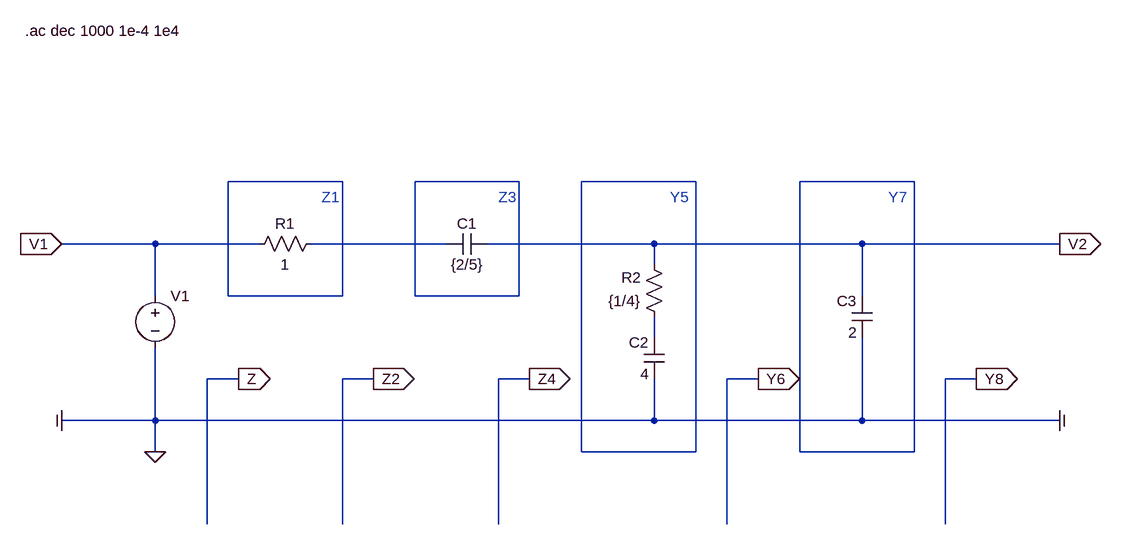
[diagram p0: schematic TS12_Ejercicio_2_LTSpice_Z11_Remociones.asc]
TS12_Ejercicio_2_LTSpice_Z11_Remociones.asc, the LTspice schematic file:
Version 4
SHEET 1 1456 772
WIRE -96 -32 -272 -32
WIRE 176 -32 16 -32
WIRE 448 -32 272 -32
WIRE 784 -32 608 -32
WIRE -384 64 -528 64
WIRE -224 64 -384 64
WIRE 64 64 -144 64
WIRE 384 64 128 64
WIRE 704 64 384 64
WIRE 1008 64 704 64
WIRE 384 96 384 64
WIRE -384 144 -384 64
WIRE -272 144 -272 -32
WIRE -96 144 -96 -32
WIRE -96 144 -272 144
WIRE 16 144 16 -32
WIRE 176 144 176 -32
WIRE 176 144 16 144
WIRE 704 144 704 64
WIRE 384 208 384 176
WIRE -256 272 -304 272
WIRE -48 272 -96 272
WIRE 192 272 144 272
WIRE 544 272 496 272
WIRE 880 272 832 272
WIRE -384 336 -384 224
WIRE -384 336 -528 336
WIRE 384 336 384 272
WIRE 384 336 -384 336
WIRE 704 336 704 208
WIRE 704 336 384 336
WIRE 1008 336 704 336
WIRE -384 384 -384 336
WIRE 272 384 272 -32
WIRE 448 384 448 -32
WIRE 448 384 272 384
WIRE 608 384 608 -32
WIRE 784 384 784 -32
WIRE 784 384 608 384
WIRE -304 496 -304 272
WIRE -96 496 -96 272
WIRE 144 496 144 272
WIRE 496 496 496 272
WIRE 832 496 832 272
FLAG 1008 64 V2
IOPIN 1008 64 Out
FLAG -528 64 V1
IOPIN -528 64 In
FLAG -384 384 0
FLAG -528 336 COM
IOPIN -528 336 In
FLAG 1008 336 COM
IOPIN 1008 336 Out
FLAG -256 272 Z
IOPIN -256 272 Out
FLAG -48 272 Z2
IOPIN -48 272 Out
FLAG 192 272 Z4
IOPIN 192 272 Out
FLAG 544 272 Y6
IOPIN 544 272 Out
FLAG 880 272 Y8
IOPIN 880 272 Out
SYMBOL res -128 48 R90
WINDOW 0 0 56 VBottom 2
WINDOW 3 32 56 VTop 2
SYMATTR InstName R1
SYMATTR Value 1
SYMBOL res 400 192 R180
WINDOW 0 36 76 Left 2
WINDOW 3 36 40 Left 2
SYMATTR InstName R2
SYMATTR Value {1/4}
SYMBOL cap 128 48 R90
WINDOW 0 0 32 VBottom 2
WINDOW 3 32 32 VTop 2
SYMATTR InstName C1
SYMATTR Value {2/5}
SYMBOL cap 400 272 R180
WINDOW 0 24 56 Left 2
WINDOW 3 24 8 Left 2
SYMATTR InstName C2
SYMATTR Value 4
SYMBOL cap 720 208 R180
WINDOW 0 24 56 Left 2
WINDOW 3 24 8 Left 2
SYMATTR InstName C3
SYMATTR Value 2
SYMBOL voltage -384 128 R0
WINDOW 39 0 0 Left 0
SYMATTR InstName V1
SYMATTR Value ""
SYMATTR Value2 AC 1 0
TEXT -584 -264 Left 2 !.ac dec 1000 1e-4 1e4
TEXT -128 -8 Left 2 ;Z1
TEXT 144 -8 Left 2 ;Z3
TEXT 408 -8 Left 2 ;Y5
TEXT 744 -8 Left 2 ;Y7

The netlist it stands for:
* TS12_Ejercicio_2_LTSpice_Z11_Remociones.asc
R1 N005 V1 1
R2 N006 V2 {1/4}
C1 V2 N005 {2/5}
C2 0 N006 4
C3 0 V2 2
V1 V1 0 AC 1 0
.ac dec 1000 1e-4 1e4
* Z1
* Z3
* Y5
* Y7
.backanno
.end